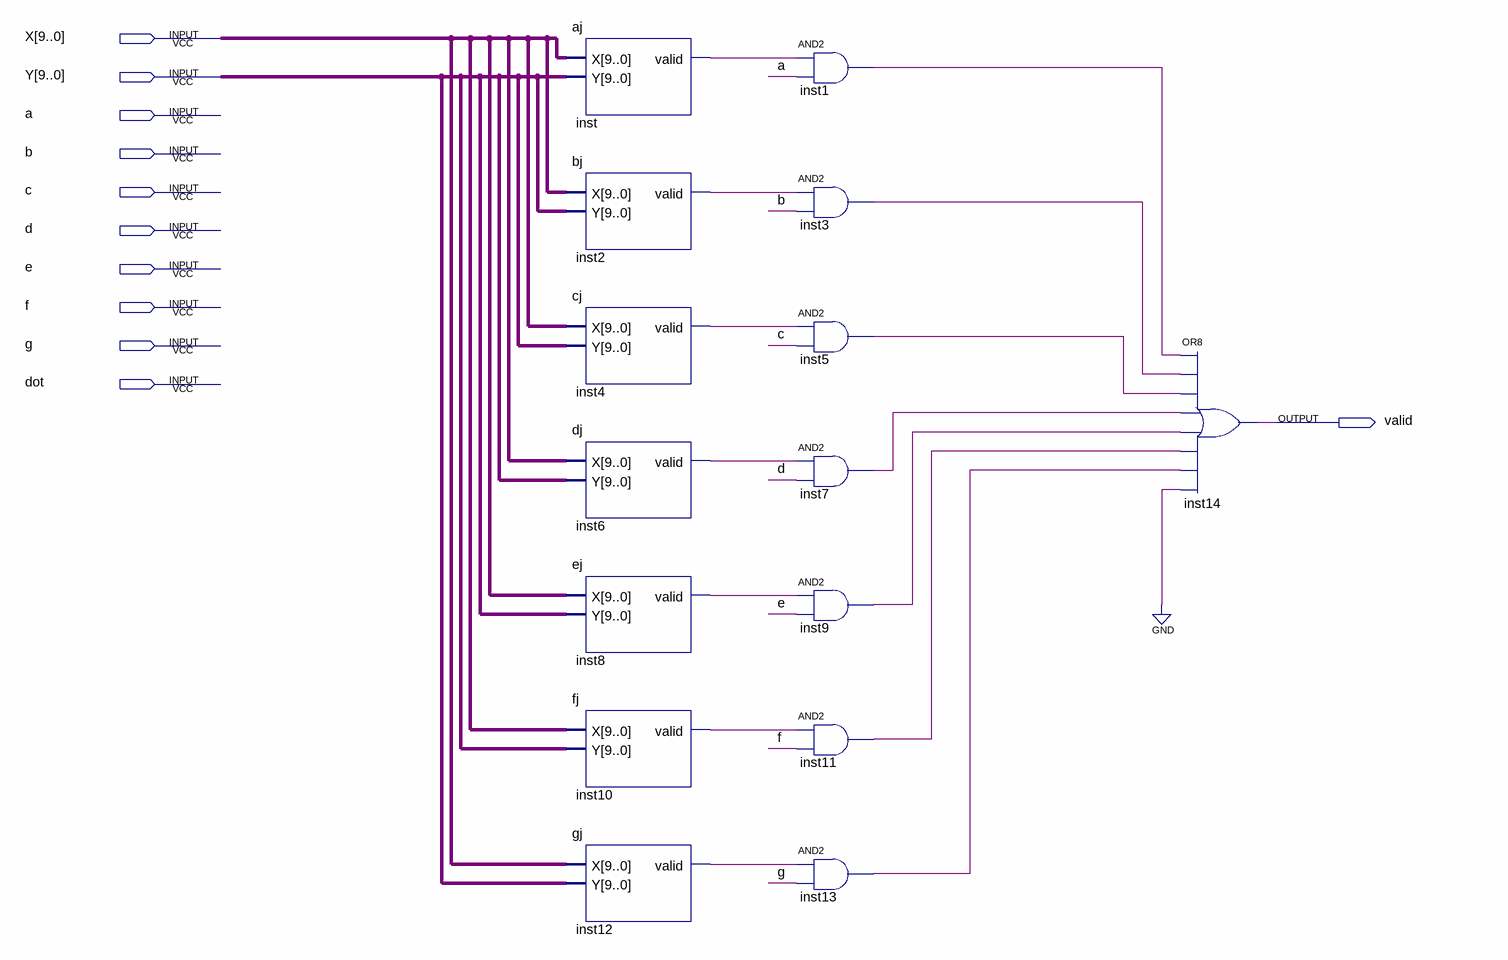
[diagram p0: schematic sheet]
// Quartus schematic SedmoSegmentniJ.bdf as structural Verilog: 15 symbols, 11 pins
module SedmoSegmentniJ (
  input  [9:0] X,
  input  [9:0] Y,
  input  a,
  input  b,
  input  c,
  input  d,
  input  e,
  input  f,
  input  g,
  input  dot,
  output valid
);

  wire inst1_out, inst2_valid, inst3_out, inst4_valid, inst5_out, inst6_valid, inst7_out, inst8_valid,
       inst9_out, inst10_valid, inst11_out, inst12_valid, inst13_out, inst_valid;

  aj inst (.X(X), .Y(Y), .valid(inst_valid));
  bj inst2 (.X(X), .Y(Y), .valid(inst2_valid));
  cj inst4 (.X(X), .Y(Y), .valid(inst4_valid));
  dj inst6 (.X(X), .Y(Y), .valid(inst6_valid));
  ej inst8 (.X(X), .Y(Y), .valid(inst8_valid));
  fj inst10 (.X(X), .Y(Y), .valid(inst10_valid));
  gj inst12 (.X(X), .Y(Y), .valid(inst12_valid));
  and inst1 (inst1_out, inst_valid, a);
  and inst3 (inst3_out, inst2_valid, b);
  and inst5 (inst5_out, inst4_valid, c);
  and inst7 (inst7_out, inst6_valid, d);
  and inst9 (inst9_out, inst8_valid, e);
  and inst11 (inst11_out, inst10_valid, f);
  and inst13 (inst13_out, inst12_valid, g);
  or inst14 (valid, inst1_out, inst3_out, inst5_out, inst7_out, inst9_out, inst11_out, inst13_out, 1'b0);
endmodule
